# Altium schematic sheet Temctrl_O.SchDoc
size A4
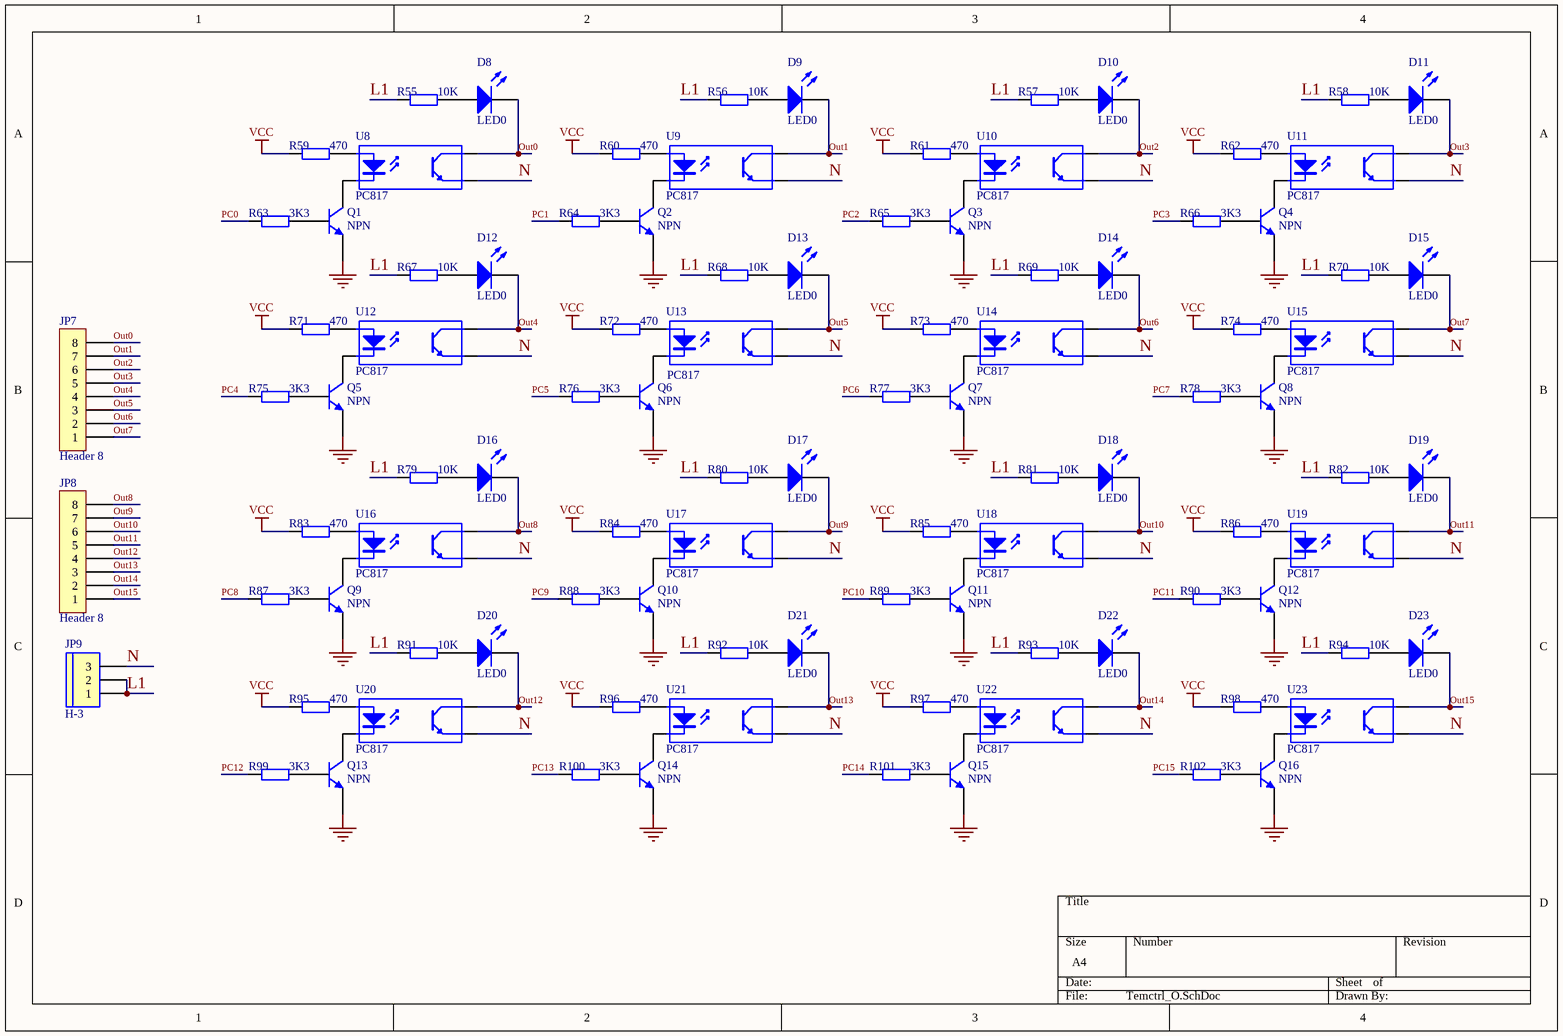
[diagram p0: Temctrl_O.SchDoc]

## Parts
D8  LED0  [LED0.1-0.22]
D9  LED0  [LED0.1-0.22]
D10  LED0  [LED0.1-0.22]
D11  LED0  [LED0.1-0.22]
D12  LED0  [LED0.1-0.22]
D13  LED0  [LED0.1-0.22]
D14  LED0  [LED0.1-0.22]
D15  LED0  [LED0.1-0.22]
D16  LED0  [LED0.1-0.22]
D17  LED0  [LED0.1-0.22]
D18  LED0  [LED0.1-0.22]
D19  LED0  [LED0.1-0.22]
D20  LED0  [LED0.1-0.22]
D21  LED0  [LED0.1-0.22]
D22  LED0  [LED0.1-0.22]
D23  LED0  [LED0.1-0.22]
JP7  Header 8  [HEAD8B-H - X]
JP8  Header 8  [HEAD8B-H - X]
JP9  H-3  [P3]
Q1  NPN  [S9013SMD]
Q2  NPN  [S9013SMD]
Q3  NPN  [S9013SMD]
Q4  NPN  [S9013SMD]
Q5  NPN  [S9013SMD]
Q6  NPN  [S9013SMD]
Q7  NPN  [S9013SMD]
Q8  NPN  [S9013SMD]
Q9  NPN  [S9013SMD]
Q10  NPN  [S9013SMD]
Q11  NPN  [S9013SMD]
Q12  NPN  [S9013SMD]
Q13  NPN  [S9013SMD]
Q14  NPN  [S9013SMD]
Q15  NPN  [S9013SMD]
Q16  NPN  [S9013SMD]
R55  10K  [0805]
R56  10K  [0805]
R57  10K  [0805]
R58  10K  [0805]
R59  470  [0805]
R60  470  [0805]
R61  470  [0805]
R62  470  [0805]
R63  3K3  [0805]
R64  3K3  [0805]
R65  3K3  [0805]
R66  3K3  [0805]
R67  10K  [0805]
R68  10K  [0805]
R69  10K  [0805]
R70  10K  [0805]
R71  470  [0805]
R72  470  [0805]
R73  470  [0805]
R74  470  [0805]
R75  3K3  [0805]
R76  3K3  [0805]
R77  3K3  [0805]
R78  3K3  [0805]
R79  10K  [0805]
R80  10K  [0805]
R81  10K  [0805]
R82  10K  [0805]
R83  470  [0805]
R84  470  [0805]
R85  470  [0805]
R86  470  [0805]
R87  3K3  [0805]
R88  3K3  [0805]
R89  3K3  [0805]
R90  3K3  [0805]
R91  10K  [0805]
R92  10K  [0805]
R93  10K  [0805]
R94  10K  [0805]
R95  470  [0805]
R96  470  [0805]
R97  470  [0805]
R98  470  [0805]
R99  3K3  [0805]
R100  3K3  [0805]
R101  3K3  [0805]
R102  3K3  [0805]
U8  PC817  [DIP-4]
U9  PC817  [DIP-4]
U10  PC817  [DIP-4]
U11  PC817  [DIP-4]
U12  PC817  [DIP-4]
U13  PC817  [DIP-4]
U14  PC817  [DIP-4]
U15  PC817  [DIP-4]
U16  PC817  [DIP-4]
U17  PC817  [DIP-4]
U18  PC817  [DIP-4]
U19  PC817  [DIP-4]
U20  PC817  [DIP-4]
U21  PC817  [DIP-4]
U22  PC817  [DIP-4]
U23  PC817  [DIP-4]

## Nets
GND: Q1.3(E) Q2.3(E) Q3.3(E) Q4.3(E) Q5.3(E) Q6.3(E) Q7.3(E) Q8.3(E) Q9.3(E) Q10.3(E) Q11.3(E) Q12.3(E) Q13.3(E) Q14.3(E) Q15.3(E) Q16.3(E)
VCC: R59.1 R60.1 R61.1 R62.1 R71.1 R72.1 R73.1 R74.1 R83.1 R84.1 R85.1 R86.1 R95.1 R96.1 R97.1 R98.1
L1: JP9.1 JP9.2 R55.1 R56.1 R57.1 R58.1 R67.1 R68.1 R69.1 R70.1 R79.1 R80.1 R81.1 R82.1 R91.1 R92.1 R93.1 R94.1
N: JP9.3 U8.3(E) U9.3(E) U10.3(E) U11.3(E) U12.3(E) U13.3(E) U14.3(E) U15.3(E) U16.3(E) U17.3(E) U18.3(E) U19.3(E) U20.3(E) U21.3(E) U22.3(E) U23.3(E)
Out0: D8.2(K) JP7.8 U8.4(C)
Out1: D9.2(K) JP7.7 U9.4(C)
Out2: D10.2(K) JP7.6 U10.4(C)
Out3: D11.2(K) JP7.5 U11.4(C)
Out4: D12.2(K) JP7.4 U12.4(C)
Out5: D13.2(K) JP7.3 U13.4(C)
Out6: D14.2(K) JP7.2 U14.4(C)
Out7: D15.2(K) JP7.1 U15.4(C)
Out8: D16.2(K) JP8.8 U16.4(C)
Out9: D17.2(K) JP8.7 U17.4(C)
Out10: D18.2(K) JP8.6 U18.4(C)
Out11: D19.2(K) JP8.5 U19.4(C)
Out12: D20.2(K) JP8.4 U20.4(C)
Out13: D21.2(K) JP8.3 U21.4(C)
Out14: D22.2(K) JP8.2 U22.4(C)
Out15: D23.2(K) JP8.1 U23.4(C)
PC0: R63.1
PC1: R64.1
PC2: R65.1
PC3: R66.1
PC4: R75.1
PC5: R76.1
PC6: R77.1
PC7: R78.1
PC8: R87.1
PC9: R88.1
PC10: R89.1
PC11: R90.1
PC12: R99.1
PC13: R100.1
PC14: R101.1
PC15: R102.1
NetD8_1: D8.1(A) R55.2
NetD9_1: D9.1(A) R56.2
NetD10_1: D10.1(A) R57.2
NetD11_1: D11.1(A) R58.2
NetD12_1: D12.1(A) R67.2
NetD13_1: D13.1(A) R68.2
NetD14_1: D14.1(A) R69.2
NetD15_1: D15.1(A) R70.2
NetD16_1: D16.1(A) R79.2
NetD17_1: D17.1(A) R80.2
NetD18_1: D18.1(A) R81.2
NetD19_1: D19.1(A) R82.2
NetD20_1: D20.1(A) R91.2
NetD21_1: D21.1(A) R92.2
NetD22_1: D22.1(A) R93.2
NetD23_1: D23.1(A) R94.2
NetQ1_1: Q1.1(C) U8.2(K)
NetQ1_2: Q1.2(B) R63.2
NetQ2_1: Q2.1(C) U9.2(K)
NetQ2_2: Q2.2(B) R64.2
NetQ3_1: Q3.1(C) U10.2(K)
NetQ3_2: Q3.2(B) R65.2
NetQ4_1: Q4.1(C) U11.2(K)
NetQ4_2: Q4.2(B) R66.2
NetQ5_1: Q5.1(C) U12.2(K)
NetQ5_2: Q5.2(B) R75.2
NetQ6_1: Q6.1(C) U13.2(K)
NetQ6_2: Q6.2(B) R76.2
NetQ7_1: Q7.1(C) U14.2(K)
NetQ7_2: Q7.2(B) R77.2
NetQ8_1: Q8.1(C) U15.2(K)
NetQ8_2: Q8.2(B) R78.2
NetQ9_1: Q9.1(C) U16.2(K)
NetQ9_2: Q9.2(B) R87.2
NetQ10_1: Q10.1(C) U17.2(K)
NetQ10_2: Q10.2(B) R88.2
NetQ11_1: Q11.1(C) U18.2(K)
NetQ11_2: Q11.2(B) R89.2
NetQ12_1: Q12.1(C) U19.2(K)
NetQ12_2: Q12.2(B) R90.2
NetQ13_1: Q13.1(C) U20.2(K)
NetQ13_2: Q13.2(B) R99.2
NetQ14_1: Q14.1(C) U21.2(K)
NetQ14_2: Q14.2(B) R100.2
NetQ15_1: Q15.1(C) U22.2(K)
NetQ15_2: Q15.2(B) R101.2
NetQ16_1: Q16.1(C) U23.2(K)
NetQ16_2: Q16.2(B) R102.2
NetR59_2: R59.2 U8.1(A)
NetR60_2: R60.2 U9.1(A)
NetR61_2: R61.2 U10.1(A)
NetR62_2: R62.2 U11.1(A)
NetR71_2: R71.2 U12.1(A)
NetR72_2: R72.2 U13.1(A)
NetR73_2: R73.2 U14.1(A)
NetR74_2: R74.2 U15.1(A)
NetR83_2: R83.2 U16.1(A)
NetR84_2: R84.2 U17.1(A)
NetR85_2: R85.2 U18.1(A)
NetR86_2: R86.2 U19.1(A)
NetR95_2: R95.2 U20.1(A)
NetR96_2: R96.2 U21.1(A)
NetR97_2: R97.2 U22.1(A)
NetR98_2: R98.2 U23.1(A)

## Library data of the parts
D8-D23 = LED0: Typical INFRARED GaAs LED; Published: 8-Jun-2000; LatestRevisionDate: 08-Jul-2005; LatestRevisionNote: Mech Layer 1 removed.; PackageReference: LED-0; Publisher: Altium Limited
JP7 JP8 = Header 8: Header, 8-Pin; Manufacturer: Generic Components; Class: Connector
JP9 = H-3: Header, 3-Pin; Manufacturer: Generic Components; Class: Connector
Q1-Q16 = NPN: NPN Bipolar Transistor; Published: 8-Jun-2000; LatestRevisionDate: 17-Jul-2002; LatestRevisionNote: Re-released for DXP Platform.; PackageReference: TO-226; Publisher: Altium Limited; Code_JEDEC: TO-226-AA
R55-R102 = Res: Resistor; Manufacturer: Generic Components; Class: Passive; Published: 08/06/2000; Publisher: Altium Hobart Technology Centre; SubClass: Resistor
U8-U23 = Optoisolator1: 4-Pin Phototransistor Optocoupler; Published: 24-Mar-1999; LatestRevisionDate: 04-Mar-2005; LatestRevisionNote: Sch pins 3 & 4 Swapped.; DatasheetDocument: Nov-2003; PackageReference: DIP-4; Publisher: Altium Limited